# EAGLE design nexa_remote (EAGLE 7.7.0)
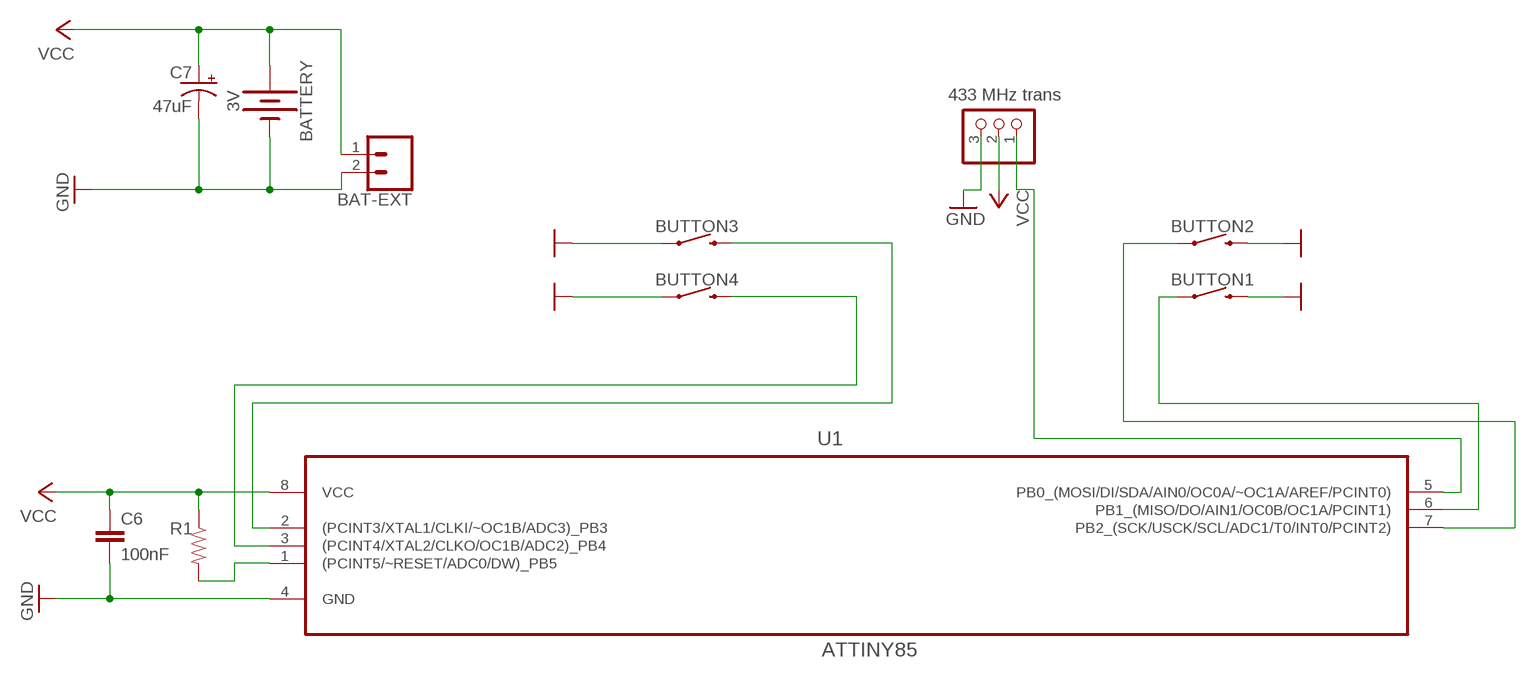
[diagram p0: schematic, sheet 1]

## Parts
BAT-EXT  CONN_023.5MM  [SCREWTERMINAL-3.5MM-2]
BATTERY  3V  BATTERY-20MM_SMD_4LEGS  [BATTCON_20MM_4LEGS]
BUTTON1  MOMENTARY-SWITCH-SPST-PTH-6.0MM  [TACTILE_SWITCH_PTH_6.0MM]
BUTTON2  MOMENTARY-SWITCH-SPST-PTH-6.0MM  [TACTILE_SWITCH_PTH_6.0MM]
BUTTON3  MOMENTARY-SWITCH-SPST-PTH-6.0MM  [TACTILE_SWITCH_PTH_6.0MM]
BUTTON4  MOMENTARY-SWITCH-SPST-PTH-6.0MM  [TACTILE_SWITCH_PTH_6.0MM]
C6  100nF  0.33UF/330NF-0805-50V-10%  [0805]
C7  47uF  10UF-POLAR-RADIAL-2.5MM-25V-20%  [CPOL-RADIAL-2.5MM-5MM]
JMR-TX-1  433 MHz trans  PINHD-1X3CB  [1X03-CLEANBIG]
R1  10K  0.3OHM-0805-1/8W-1%  [0805]
U1  ATTINY85  ATTINY85-20PU  [DIP254P762X533-8]

## Nets
GND [supply]: BAT-EXT.2 BATTERY.NEGATIVE(-) BUTTON1.3 BUTTON2.3 BUTTON3.1 BUTTON4.1 C6.2 C7.2(-) JMR-TX-1.3 U1.4(GND)
N$1: R1.2 U1.1((PCINT5/~RESET/ADC0/DW)_PB5)
N$5: JMR-TX-1.1 U1.5(PB0_(MOSI/DI/SDA/AIN0/OC0A/~OC1A/AREF/PCINT0))
N$9: BUTTON1.1 U1.6(PB1_(MISO/DO/AIN1/OC0B/OC1A/PCINT1))
N$12: BUTTON3.3 U1.2((PCINT3/XTAL1/CLKI/~OC1B/ADC3)_PB3)
N$13: BUTTON4.3 U1.3((PCINT4/XTAL2/CLKO/OC1B/ADC2)_PB4)
N$21: BUTTON2.1 U1.7(PB2_(SCK/USCK/SCL/ADC1/T0/INT0/PCINT2))
VCC [supply]: BAT-EXT.1 BATTERY.POSITIVE@1(+) BATTERY.POSITIVE@2(+) BATTERY.POSITIVE@3(+) BATTERY.POSITIVE@4(+) C6.1 C7.1(+) JMR-TX-1.2 R1.1 U1.8(VCC)

## Library data of the parts
BAT-EXT = SparkFun-Connectors:CONN_02: Multi connection point. Often used as Generic Header-pin footprint for 0.1 inch spaced/style header connections On any of the 0.1 inch spaced packages, you can populate with these: Break Away Headers - Straight <https://www.sparkfun.com/products/116> (PRT-00116) Break Away Male Headers - Right Angle <https://www.sparkfun.com/products/553> (PRT-00553) Female Headers <https://www.sparkfun.com/products/115> (PRT-00115) Break Away Headers - Machine Pin <https://www.sparkfun.com/products/117> (PRT-00117) Break Away Female Headers - Swiss Machine Pin <https://www.sparkfun.com/products/743> (PRT-00743) For SCREWTERMINALS and SPRING TERMINALS visit here: Screw Terimnals on SparkFun.com <https://www.sparkfun.com/search/results?term=Screw+Terminals> (5mm/3.5mm/2.54mm spacing) This device is also useful as a general connection point to wire up your design to another part of your project. Our various solder wires solder well into these plated through hole pads. Hook-Up Wire - Assortment (Stranded, 22 AWG) <https://www.sparkfun.com/products/11375> (PRT-11375) Hook-Up Wire - Assortment (Solid Core, 22 AWG) <https://www.sparkfun.com/products/11367> (PRT-11367) View the entire wire category on our website here <https://www.sparkfun.com/categories/141> Special notes: Molex polarized connector foot print use with: PRT-08233 with associated crimp pins and housings. 2.54_SCREWTERM for use with PRT-10571. 3.5mm Screw Terminal footprints for PRT-08084 5mm Screw Terminal footprints for use with PRT-08432; PROD_ID: CONN-08399
BATTERY = SparkFun-Batteries:BATTERY: Battery - Single Cell A variety of battery chemistries, sizes, and footprints. Device List: 20MM_PTH - Coin Cell Battery Holder - 20mm (PTH) <https://www.sparkfun.com/products/783> 12MM_SMD - Coin Cell Battery Holder - 12mm (SMD) <https://www.sparkfun.com/products/10592> 12MM_PTH - Coin Cell Battery Holder - 12mm (PTH) <https://www.sparkfun.com/products/7948> 20MM_SMD - 20mm Coin Cell Battery Holder (SMD) (2 legs) Used on the Big Time Watch Kit <https://www.sparkfun.com/products/11734> 20MM_SMD_4LEGS - Coin Cell Battery Holder - 20mm (SMD) <https://www.sparkfun.com/products/11892> 20MM_SMD_4LEGS_OVERPASTE - Coin Cell Battery Holder - 20mm (SMD) <https://www.sparkfun.com/products/11892> (Over-paste on the legs) 24.5MM_PTH - Coin Cell Battery Holder - 24.5mm (PTH) <https://www.sparkfun.com/products/8863> 9V - 9V Battery Holder - PC Mount Used on the SparkFun SparkPunk Sound Kit <https://www.sparkfun.com/products/11177> and SparkFun SparkPunk Sequencer Kit <https://www.sparkfun.com/products/12707> 18650 - Battery Holder - 18650 (PTH) <https://www.sparkfun.com/products/13113> AA - Battery Holder - 1xAA (PTH) <https://www.sparkfun.com/products/7949> AAA - Battery Holder - 1xAAA (PTH) <https://www.sparkfun.com/products/12718> AA_KIT - Battery Holder - 1xAA (PTH) <https://www.sparkfun.com/products/7949> Special kit package - pads only have exposed copper on one side of the board. AAA_KIT - Battery Holder - 1xAAA (PTH) <https://www.sparkfun.com/products/12718> Special kit package - pads only have exposed copper on one side of the board.; PROD_ID: BATT-10373; SF_SKU: PRT-11892
BUTTON1-BUTTON4 = SparkFun-Switches:MOMENTARY-SWITCH-SPST: Momentary Switch (Pushbutton) - SPST Normally-open (NO) SPST momentary switches (buttons, pushbuttons). Variants PTH-12MM - 12mm square, through-hole Momentary Pushbutton Switch - 12mm Square <https://www.sparkfun.com/products/9190> (COM-09190) PTH-6.0MM, PTH-6.0MM-KIT - 6.0mm square, through-hole Mini Pushbutton Switch <https://www.sparkfun.com/products/97> (COM-00097) KIT package intended for soldering kit's - only one side of pads' copper is exposed. PTH-RIGHT-ANGLE-KIT - Right-angle, through-hole Right Angle Tactile Button <https://www.sparkfun.com/products/10791> - Used on SparkFun BigTime Watch Kit <https://www.sparkfun.com/products/11734> SMD-12MM - 12mm square, surface-mount Tactile Button - SMD (12mm) <https://www.sparkfun.com/products/12993> (COM-12993) Used on SparkFun PicoBoard <https://www.sparkfun.com/products/11888> SMD-4.5MM - 4.5mm Square Trackball Switch Used on SparkFun Blackberry Trackballer Breakout <https://www.sparkfun.com/products/13169> SMD-4.6MMX2.8MM - 4.60mm x 2.80mm, surface mount Used on SparkFun SAMD21 Mini Breakout <https://www.sparkfun.com/products/13664> SMD-5.2MM, SMD-5.2-REDUNDANT - 5.2mm square, surface-mount Mini Pushbutton Switch - SMD <https://www.sparkfun.com/products/8720> (COM-08720) Used on Arduino Pro Mini <https://www.sparkfun.com/products/11114> REDUNDANT package connects both switch circuits together SMD-6.0X3.5MM - 6.0 x 3.5mm, surface mount Momentary Reset Switch SMD <https://www.sparkfun.com/products/8229> (COM-08229) SMD-6.2MM-TALL - 6.2mm square, surface mount Tactile Button - SMD (6mm) <https://www.sparkfun.com/products/12992> Used on SparkFun Digital Sandbox <https://www.sparkfun.com/products/12651> SMD-RIGHT-ANGLE - Right-angle, surface mount Used on SparkFun Block for Intel® Edison - Arduino <https://www.sparkfun.com/products/13036>; PROD_ID: SWCH-08441; SF_SKU: COM-00097
C6 = SparkFun-Capacitors:0.33UF/330NF: 0.33µF/330nF ceramic capacitors A capacitor is a passive two-terminal electrical component used to store electrical energy temporarily in an electric field.; PROD_ID: CAP-08469; VALUE: 0.33µF
C7 = SparkFun-Capacitors:10UF-POLAR: 10.0µF polarized capacitors A capacitor is a passive two-terminal electrical component used to store electrical energy temporarily in an electric field.; PROD_ID: CAP-08440; VALUE: 10uF
JMR-TX-1 = adafruit:PINHD-1X3: PIN HEADER
R1 = SparkFun-Resistors:0.3OHM: 0.3Ω resistor A resistor is a passive two-terminal electrical component that implements electrical resistance as a circuit element. Resistors act to reduce current flow, and, at the same time, act to lower voltage levels within circuits. - Wikipedia; PROD_ID: RES-11622; VALUE: 0.3
U1 = Atmel_By_element14_Batch_1-00:ATTINY85-20PU: 8-bit Microcontroller with In-System Programmable Flash; MPN: ATTINY85-20PU; OC_FARNELL: 1455162; OC_NEWARK: 58M3796; PACKAGE: PDIP-8; SUPPLIER: Atmel

## Net classes
0 default: width 0.254 mm, clearance 0.254 mm
1 supply: width 0.508 mm, clearance 0.508 mm

## Board
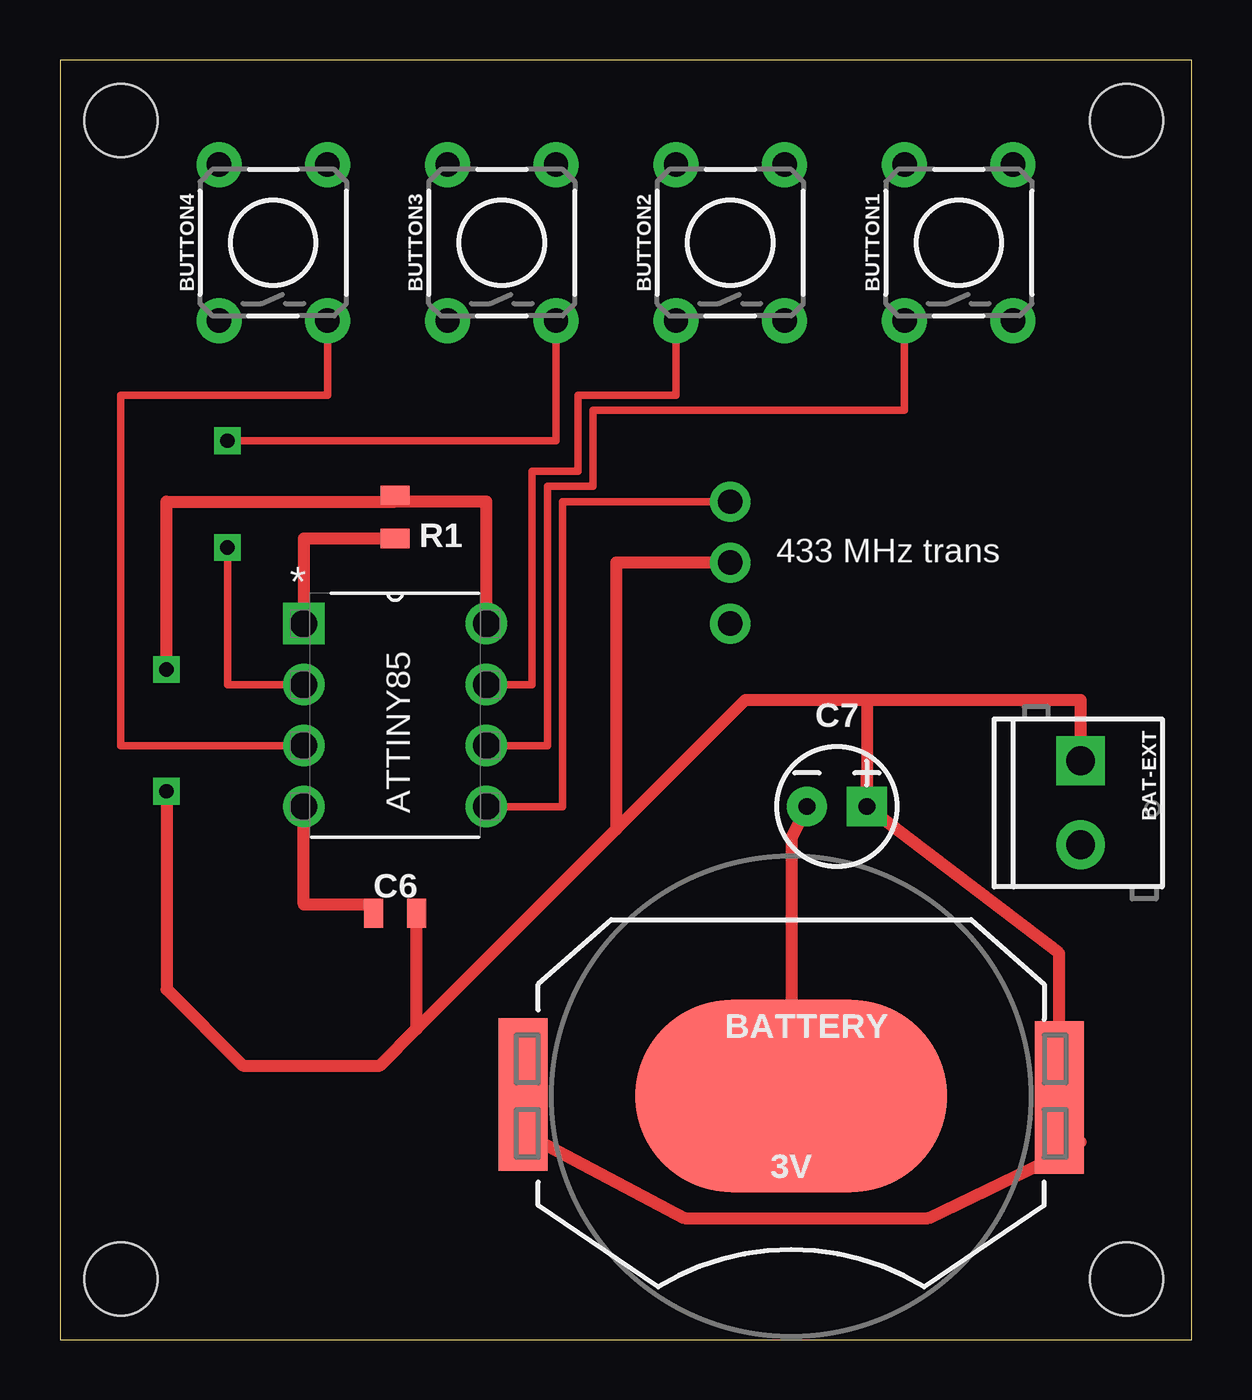
[diagram p1: board, top side]
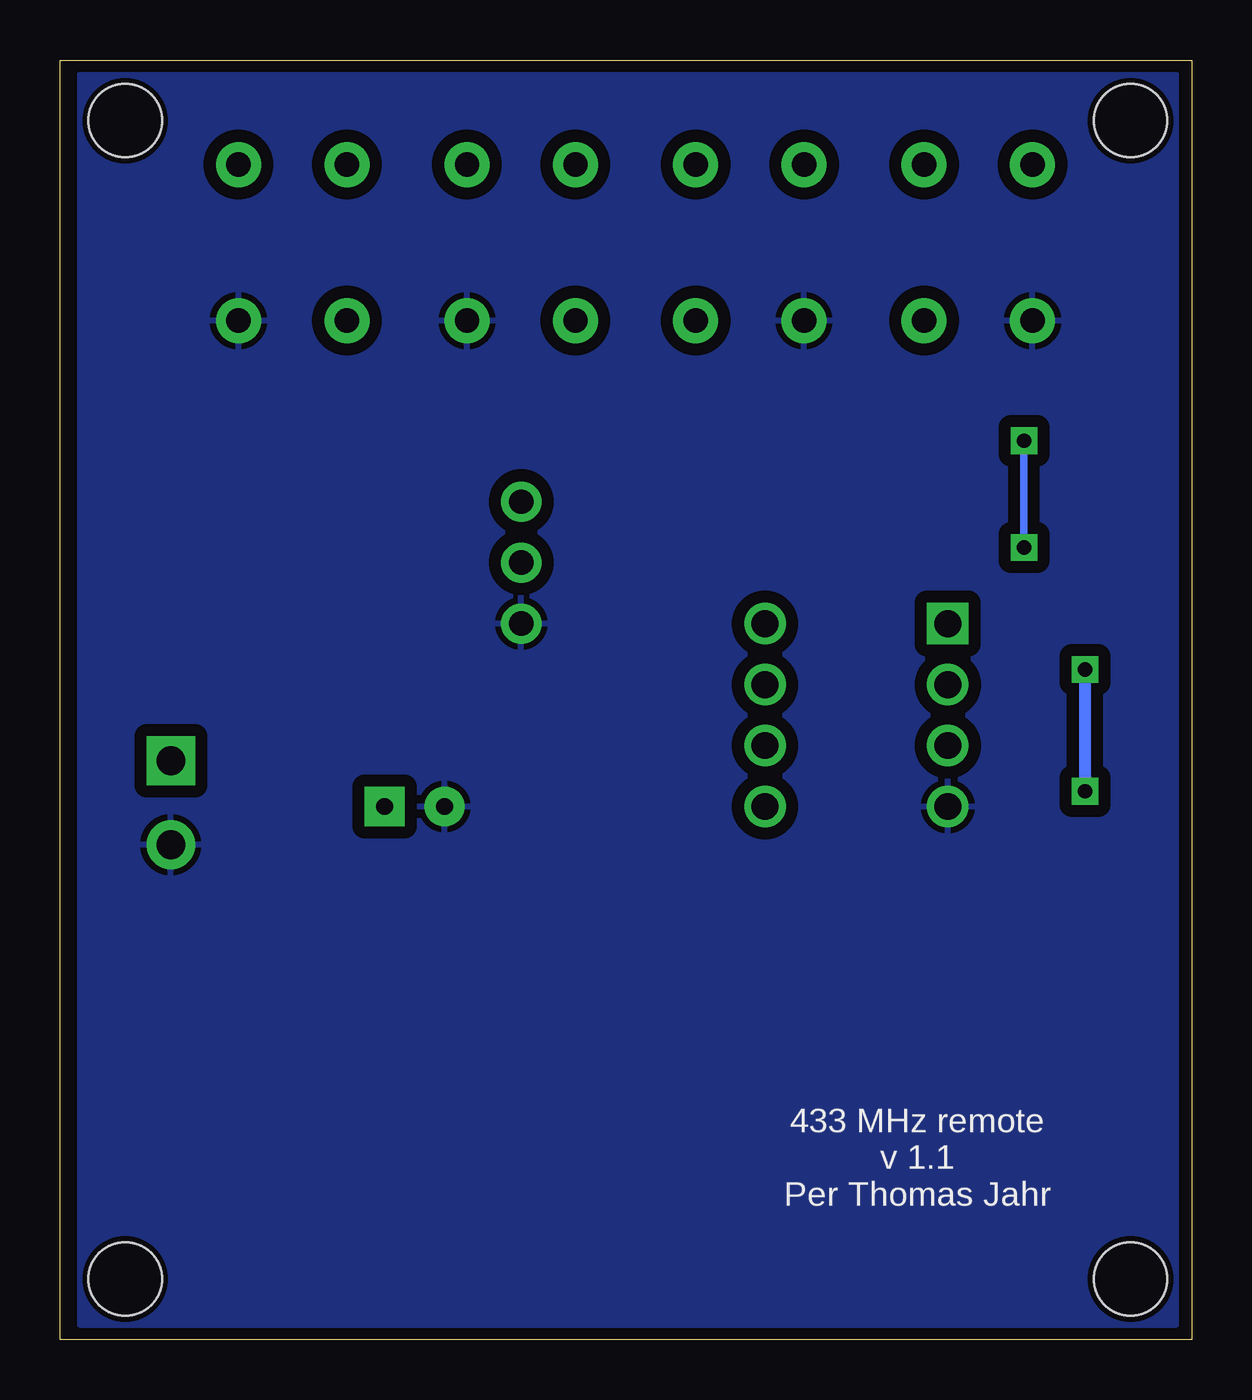
[diagram p2: board, bottom side, seen from below]

Size 47.17 x 53.33 mm. Coordinates in mm from the lower left corner, seen from the top.
Outline: 0,0 47.17,0 47.17,53.33 0,53.33 0,0
Copper layers (1*16): Top 0.035mm / dielectric 1.5mm / Bottom 0.035mm
Design rules "SparkFun": minimum track width 8mil, minimum drill 20mil, track to track 8mil, track to pad 8mil, pad to pad 8mil, via to via 8mil, smd to smd 8mil, copper to edge 10mil, drill to drill 8mil, minimum pad ring 12mil, minimum via ring 10mil, stop-mask expansion 4mil, vias tented up to drill 25mil, thermal gap 10mil
Holes 3.05 mm at 2.54,50.8 44.45,50.8 2.54,2.54 44.45,2.54

### Footprints (pad centres in the part's own frame; a part is rotated, then mirrored left to right if it is on the bottom)
SCREWTERMINAL-3.5MM-2 = drill 1.2 pad 2.032 square: 1 0,0 | drill 1.2 pad 2.032: 2 3.5,0
BATTCON_20MM_4LEGS = smd 13 x 8: NEGATIVE 0,0 | smd 2.032 x 3.175: POSITIVE@1 -11.176,1.651; POSITIVE@2 -11.176,-1.524; POSITIVE@3 11.176,1.524; POSITIVE@4 11.176,-1.651
TACTILE_SWITCH_PTH_6.0MM = drill 1.016 pad 1.88: 1 -3.251,2.261; 2 3.251,2.261; 3 -3.251,-2.261; 4 3.251,-2.261
0805 = smd 0.8 x 1.2: 1 -0.9,0; 2 0.9,0
CPOL-RADIAL-2.5MM-5MM = drill 0.7 pad 1.651 square: 1 1.25,0 | drill 0.7 pad 1.651: 2 -1.25,0
1X03-CLEANBIG = drill 1.016 pad 1.676: 1 -2.54,0; 2 0,0; 3 2.54,0
DIP254P762X533-8 = drill 1.118 square: 1 -7.62,7.62 | drill 1.118: 2 -7.62,5.08; 3 -7.62,2.54; 4 -7.62,0; 5 0,0; 6 0,2.54; 7 0,5.08; 8 0,7.62

### Placement (x,y rotation side)
BAT-EXT  42.55,24.13 270 top
BATTERY  30.48,10.16 0 top
BUTTON1  37.47,45.72 90 top
BUTTON2  27.94,45.72 90 top
BUTTON3  18.41,45.72 90 top
BUTTON4  8.89,45.72 90 top
C6  13.97,17.78 180 top
C7  32.38,22.23 0 top
JMR-TX-1  27.94,32.38 270 top
R1  13.97,34.29 270 top
U1  17.78,22.23 0 top

### Tracks (layer width: path | path; a pad name or v marks a point on that pad's centre or on a via)
GND
  Top 0.508: C7.2 30.48,20.93 BATTERY.NEGATIVE | U1.4 10.16,18.15 13.07,18.15 C6.2
  pour Bottom: 0.64,52.7 46.35,52.7 46.35,0.64 0.64,0.64
N$1
  Top 0.508: R1.2 10.16,33.39 U1.1
N$5
  Top 0.305: U1.5 20.95,22.23 20.95,34.92 JMR-TX-1.1
N$9
  Top 0.305: U1.6 20.32,24.77 20.32,35.56 22.23,35.56 22.23,38.73 35.2,38.73 BUTTON1.1
N$12  (via drill 0.6)
  Top 0.305: U1.2 6.99,27.3 v6.99,33.02 | v6.99,37.47 20.68,37.47 BUTTON3.3
  Bottom 0.305: v6.99,33.02 v6.99,37.47
N$13
  Top 0.305: U1.3 2.54,24.77 2.54,39.37 11.15,39.37 BUTTON4.3
N$21
  Top 0.305: U1.7 19.68,27.3 19.68,36.2 21.59,36.2 21.59,39.37 25.68,39.37 BUTTON2.1
VCC  (via drill 0.6)
  Top 0.508: 14.87,12.96 13.34,11.43 7.62,11.43 4.45,14.61 v4.45,22.86 | 14.87,12.96 C6.1 | BATTERY.POSITIVE@4 42.04,8.89 41.91,8.26 | BATTERY.POSITIVE@4 42.55,8.26 | BATTERY.POSITIVE@4 BATTERY.POSITIVE@3 41.66,16.11 C7.1 33.63,23.48 33.66,23.5 | BATTERY.POSITIVE@4 42.29,8 36.2,5.08 26.04,5.08 BATTERY.POSITIVE@2 BATTERY.POSITIVE@1 | 14.87,12.96 23.18,21.27 | 23.18,21.27 28.57,26.67 33.66,26.67 | 33.66,22.86 33.66,23.5 | 33.66,23.5 33.66,26.67 | 33.66,26.67 42.55,26.67 BAT-EXT.1 | v4.45,27.94 4.45,34.92 13.97,34.92 | U1.8 17.78,34.92 13.97,34.92 | 13.97,34.92 R1.1 | JMR-TX-1.2 23.18,32.38 23.18,21.27
  Bottom 0.508: v4.45,27.94 v4.45,22.86

### Text on the board
bPlace: 433 MHz remote / v 1.1 / Per Thomas Jahr